# Altium schematic sheet stm32_ros_car.SchDoc
size A4
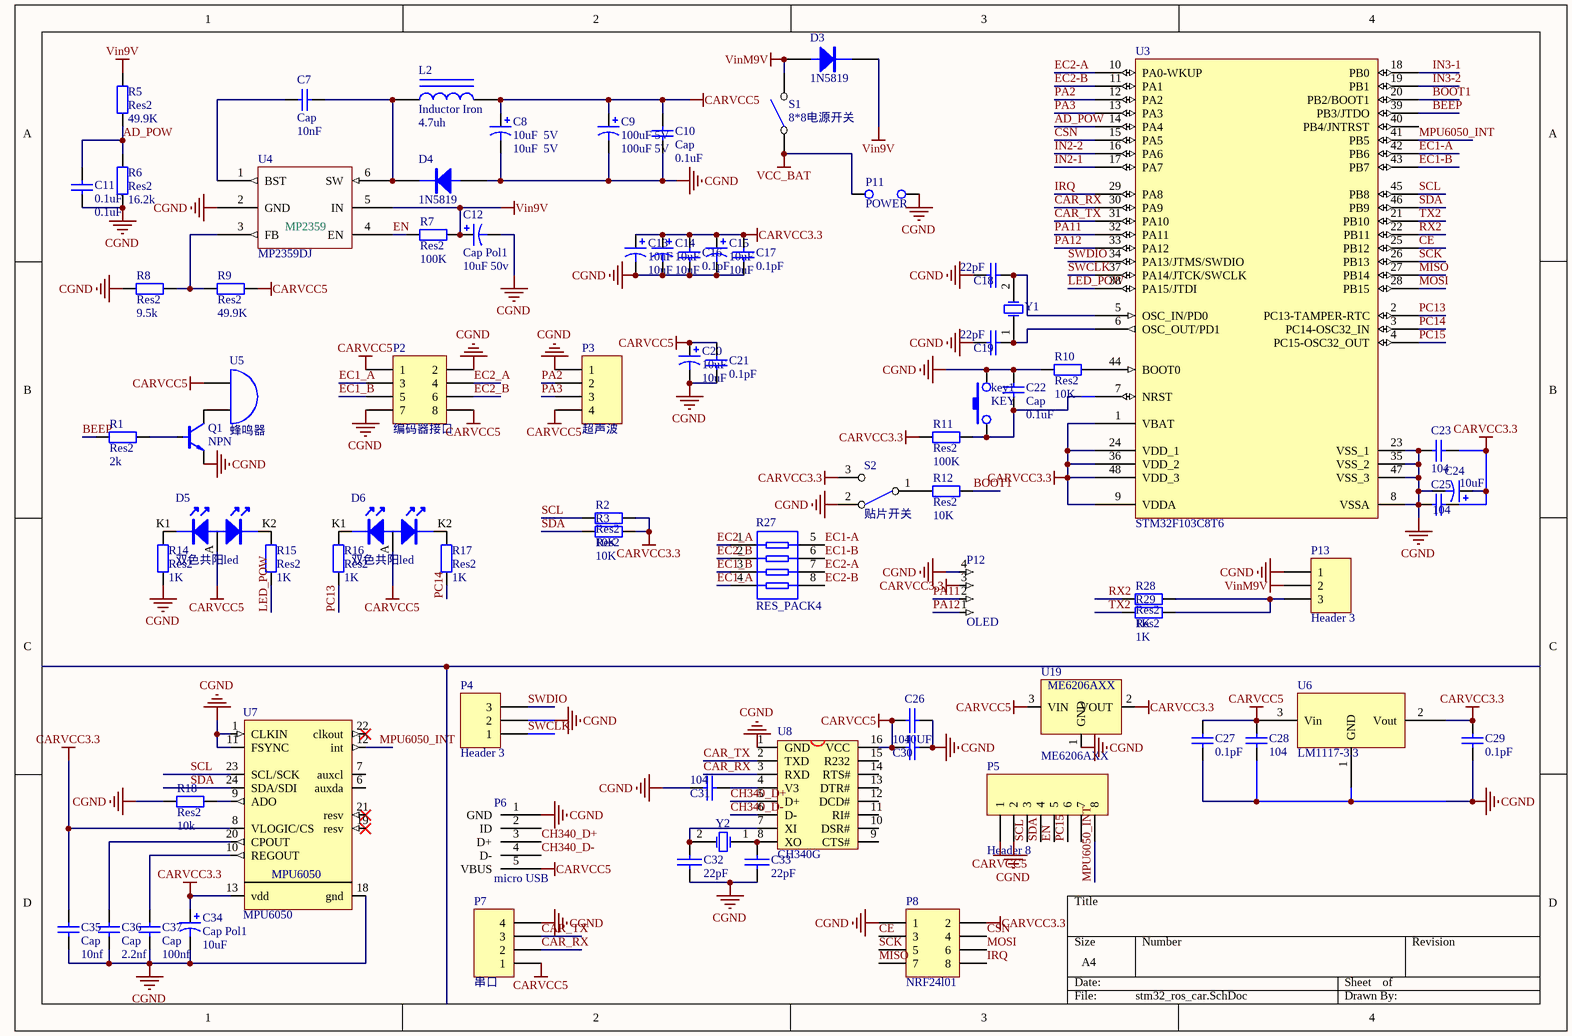
[diagram p0: stm32_ros_car.SchDoc]

## Parts
C7  Cap  value 10nF  [LC-0603_C]
C8  10uF  5V  [LC-1210_C]
C9  100uF 5V  [电容HONOR_63X77]
C10  Cap  value 0.1uF  [LC-0603_C]
C11  0.1uF  [LC-0603_C]
C12  Cap Pol1  value 10uF 50v  [电容HONOR_63X54]
C13  10uF  [电容HONOR_63X77]
C14  10uF  [LC-1210_C]
C15  10uF  [LC-1210_C]
C16  value 0.1pF  [LC-0603_C]  (hidden comment: Cap)
C17  value 0.1pF  [LC-0603_C]  (hidden comment: Cap)
C18  value 22pF  [LC-0603_C]  (hidden comment: CAP)
C19  value 22pF  [LC-0603_C]  (hidden comment: CAP)
C20  10uF  [LC-1210_C]
C21  value 0.1pF  [LC-0603_C]  (hidden comment: Cap)
C22  Cap  value 0.1uF  [LC-0603_C]
C23  value 104  [LC-0603_C]  (hidden comment: Cap)
C24  value 10uF  [LC-1210_C]
C25  value 104  [LC-0603_C]  (hidden comment: Cap)
C26  value 10UF  [LC-0603_C]  (hidden comment: CAP)
C27  value 0.1pF  [LC-0603_C]  (hidden comment: Cap)
C28  value 104  [LC-1210_C]  (hidden comment: Cap)
C29  value 0.1pF  [LC-0603_C]  (hidden comment: Cap)
C30  value 104  [LC-1206_C]  (hidden comment: CAP)
C31  value 104  [LC-0603_C]  (hidden comment: CAP)
C32  value 22pF  [LC-0603_C]  (hidden comment: CAP)
C33  value 22pF  [LC-0603_C]  (hidden comment: CAP)
C34  Cap Pol1  value 10uF  [LC-1210_C]
C35  Cap  value 10nf  [LC-0603_C]
C36  Cap  value 2.2nf  [LC-0603_C]
C37  Cap  value 100nf  [LC-0603_C]
D3  1N5819  [SMA]
D4  1N5819  [SMA]
D5  双色共阳led  [共阳双色LED]
D6  双色共阳led  [共阳双色LED]
key1  KEY  [SMD轻触按键]
L2  Inductor Iron  value 4.7uh  [电感GDCD4532]
P2  编码器接口  [HDR2X4]
P3  超声波  [HDR1X4]
P4  Header 3  [HDR1X3]
P5  Header 8  [HDR1X8]
P6  micro USB  [micro 5P沉板式0.8四脚全插无导位有孔]
P7  串口  [HDR1X4]
P8  NRF24l01  [HDR2X4]
P11  POWER  [电源]
P12  OLED  [1.0MM 翻盖 下接 FPC连接器 4P]
P13  Header 3  [AMP 3针连接件]
Q1  NPN  [LC-SOT-23]
R1  Res2  value 2k  [LC-0603_R]
R2  Res2  value 10K  [LC-0603_R]
R3  Res2  value 10K  [LC-0603_R]
R5  Res2  value 49.9K  [LC-0603_R]
R6  Res2  value 16.2k  [LC-0603_R]
R7  Res2  value 100K  [LC-0603_R]
R8  Res2  value 9.5k  [LC-0603_R]
R9  Res2  value 49.9K  [LC-0603_R]
R10  Res2  value 10K  [LC-0603_R]
R11  Res2  value 100K  [LC-0603_R]
R12  Res2  value 10K  [LC-0603_R]
R14  Res2  value 1K  [LC-0603_R]
R15  Res2  value 1K  [LC-0603_R]
R16  Res2  value 1K  [LC-0603_R]
R17  Res2  value 1K  [LC-0603_R]
R18  Res2  value 10k  [LC-0603_R]
R27  RES_PACK4  [RES4]
R28  Res2  value 1K  [LC-0603_R]
R29  Res2  value 1K  [LC-0603_R]
S1  8*8电源开关  [8*8自锁开关]
S2  贴片开关  [KEY]
U3  STM32F103C8T6  [LQFP48_L]
U4  MP2359DJ  [LC-SOT-23-6]
U5  蜂鸣器  [BELL]
U6  LM1117-3.3  [SOT223]
U7  MPU6050  [QFN24]
U8  CH340G  [SOP16M]
U19  ME6206AXX  [LC-SOT-89]
Y1  12MHz  [49SMD]  (value not drawn)
Y2  12MHz  [49SMD]  (value not drawn)

## Nets
CARVCC3.3: C13.1 C14.1 C15.1 C16.1 C17.1 C23.1 C24.1 C25.1 C29.1 C34.1 C35.2 P8.2 P12.3 R2.1 R3.1 R11.1 S2.3(NO1) U3.1(VBAT) U3.9(VDDA) U3.24(VDD_1) U3.36(VDD_2) U3.48(VDD_3) U6.2(Vout) U7.8(VLOGIC/CS) U7.13(vdd) U19.2(VOUT)
CARVCC5: C8.1 C9.1 C10.2 C20.1 C21.1 C26.2 C27.1 C28.2 C30.1 D5.A D6.A L2.2 P2.1 P2.8 P3.4 P5.1 P6.5(VBUS) P7.1 R9.1 U5.1(A) U6.3(Vin) U8.16(VCC) U19.3(VIN)
CGND: C8.2 C9.2 C10.1 C11.2 C12.2 C13.2 C14.2 C15.2 C16.2 C17.2 C18.1 C19.1 C20.2 C21.2 C22.2 C23.2 C24.2 C25.2 C26.1 C27.2 C28.1 C29.2 C30.2 C31.1 C32.1 C33.1 C34.2 C35.1 C36.1 C37.1 D4.A key1.2 P2.2 P2.7 P3.1 P4.2 P5.2 P6.1(GND) P7.4 P8.1 P11.2 P12.4 P13.1 Q1.E(e) R6.2 R8.2 R10.1 R14.1 R18.2 S2.2(NC1) U3.8(VSSA) U3.23(VSS_1) U3.35(VSS_2) U3.47(VSS_3) U4.2(GND) U6.1(GND) U7.1(CLKIN) U7.11(FSYNC) U7.18(gnd) U8.1(GND) U19.1(GND)
VCC_BAT: P11.1 S1.1(COMMON1)
Vin9V: C12.1 D3.K R5.1 R7.2 U4.5(IN)
VinM9V: D3.A P13.2 S1.2(NC1)
AD_POW: C11.1 R5.2 R6.1 U3.14(PA4)
BEEP: R1.2 U3.39(PB3/JTDO)
BOOT1: R12.1 U3.20(PB2/BOOT1)
CAR_RX: P7.2 U3.30(PA9) U8.3(RXD)
CAR_TX: P7.3 U3.31(PA10) U8.2(TXD)
CE: P8.3 U3.25(PB12)
CH340_D+: P6.3(D+) U8.5(D+)
CH340_D-: P6.4(D-) U8.6(D-)
CSN: P8.4 U3.15(PA5)
EC1-A: R27.5 U3.42(PB6)
EC1-B: R27.6 U3.43(PB7)
EC1_A: P2.3 R27.4
EC1_B: P2.5 R27.3
EC2-A: R27.7 U3.10(PA0-WKUP)
EC2-B: R27.8 U3.11(PA1)
EC2_A: P2.4 R27.1
EC2_B: P2.6 R27.2
EN: P5.5 R7.1 U4.4(EN)
IN2-1: U3.17(PA7)
IN2-2: U3.16(PA6)
IN3-1: U3.18(PB0)
IN3-2: U3.19(PB1)
IRQ: P8.8 U3.29(PA8)
LED_POW: R15.1 U3.38(PA15/JTDI)
MISO: P8.7 U3.27(PB14)
MOSI: P8.6 U3.28(PB15)
MPU6050_INT: P5.8 U3.41(PB5) U7.12(int)
PA2: P3.2 U3.12(PA2)
PA3: P3.3 U3.13(PA3)
PA11: P12.2 U3.32(PA11)
PA12: P12.1 U3.33(PA12)
PC13: R16.1 U3.2(PC13-TAMPER-RTC)
PC14: R17.1 U3.3(PC14-OSC32_IN)
PC15: P5.6 U3.4(PC15-OSC32_OUT)
RX2: R28.1 U3.22(PB11)
SCK: P8.5 U3.26(PB13)
SCL: P5.3 R2.2 U3.45(PB8) U7.23(SCL/SCK)
SDA: P5.4 R3.2 U3.46(PB9) U7.24(SDA/SDI)
SWCLK: P4.1 U3.37(PA14/JTCK/SWCLK)
SWDIO: P4.3 U3.34(PA13/JTMS/SWDIO)
TX2: R29.1 U3.21(PB10)
NetC7_1: C7.1 U4.1(BST)
NetC7_2: C7.2 D4.K L2.1 U4.6(SW)
NetC18_2: C18.2 U3.5(OSC_IN/PD0) Y1.2(OSC2)
NetC19_2: C19.2 U3.6(OSC_OUT/PD1) Y1.1(OSC1)
NetC22_1: C22.1 key1.1 R11.2 U3.7(NRST)
NetC31_2: C31.2 U8.4(V3)
NetC32_2: C32.2 U8.7(XI) Y2.2(OSC2)
NetC33_2: C33.2 U8.8(XO) Y2.1(OSC1)
NetC36_2: C36.2 U7.20(CPOUT)
NetC37_2: C37.2 U7.10(REGOUT)
NetD5_K1: D5.K1 R14.2
NetD5_K2: D5.K2 R15.2
NetD6_K1: D6.K1 R16.2
NetD6_K2: D6.K2 R17.2
NetP13_3: P13.3 R28.2 R29.2
NetQ1_B: Q1.B(b) R1.1
NetQ1_C: Q1.C(c) U5.2(B)
NetR8_1: R8.1 R9.2 U4.3(FB)
NetR10_2: R10.2 U3.44(BOOT0)
NetR12_2: R12.2 S2.1(COMMON1)
NetR18_1: R18.1 U7.9(ADO)

Not connected (* = marked no-connect by the designer): P5 7; P6 2(ID); U3 40(PB4/JNTRST); U7 6(auxda) 7(auxcl) 19(resv)* 21(resv)* 22(clkout)*; U8 9(CTS#) 10(DSR#) 11(RI#) 12(DCD#) 13(DTR#) 14(RTS#) 15(R232)

## Notes on the sheet
- (in symbol MP2359DJ) MP2359

## Library data of the parts
C7 C10 C11 C16 C17 C21-C23 C25 C27-C29 C35-C37 = Cap: Capacitor; Published: 8-Jun-2000; LatestRevisionDate: 17-Jul-2002; LatestRevisionNote: Re-released for DXP Platform.; PackageReference: RAD-0.3; Publisher: Altium Limited
  C11: Value: 0.1uF
C8 C9 C12-C15 C20 C24 C34 = Cap Pol1: Polarized Capacitor (Radial); Published: 8-Jun-2000; LatestRevisionDate: 17-Jul-2002; LatestRevisionNote: Re-released for DXP Platform.; PackageReference: RB7.6-15; Publisher: Altium Limited
  C8: Value: 10uF  5V
  C9: Value: 100uF 5V
  C13-C15 C20: Value: 10uF
D3 D4 = 1N4001: pin to pad: A>1 K>2
D5 D6 = 双色共阳led: pin to pad: A>2 K1>1 K2>3
L2 = Inductor Iron: Magnetic-Core Inductor; Published: 24-Mar-1999; LatestRevisionDate: 17-Jul-2002; LatestRevisionNote: Re-released for DXP Platform.; PackageReference: AXIAL-0.9; Publisher: Altium Limited
P2 P8 = Header 4X2: Header, 4-Pin, Dual row; LatestRevisionDate: 17-Jul-2002; LatestRevisionNote: Re-released for DXP Platform.; Publisher: Altium Limited
P3 P7 = Header 4: Header, 4-Pin; LatestRevisionDate: 17-Jul-2002; LatestRevisionNote: Re-released for DXP Platform.; Publisher: Altium Limited
P4 P13 = Header 3: Header, 3-Pin; LatestRevisionDate: 17-Jul-2002; LatestRevisionNote: Re-released for DXP Platform.; Publisher: Altium Limited
P5 = Header 8: Header, 8-Pin; LatestRevisionDate: 17-Jul-2002; LatestRevisionNote: Re-released for DXP Platform.; Publisher: Altium Limited
P6 = micro 5P
P12 = FPC 4P 1MM
Q1 = NPN: pin to pad: B>1 C>3 E>2
R1-R3 R5-R12 R14-R18 R28 R29 = Res2: Resistor; Published: 8-Jun-2000; LatestRevisionDate: 17-Jul-2002; LatestRevisionNote: Re-released for DXP Platform.; PackageReference: AXIAL-0.4; Publisher: Altium Limited
S1 = 8*8电源开关: pin to pad: 1>2 2>1
S2 = 贴片开关: pin to pad: 1>2 2>1
U3 = STM32F103C8T6: STM32 ARM-based 32-bit MCU with 64 Kbytes Flash, 48-pin LQFP, Industrial Temperature; Published: 30-May-2008; DatasheetVersion: rev6, Mar-2008; PackageVersion: Mar-2008; PackageReference: LQFP48; Publisher: Altium Limited; PackageDescription: 48-Pin Low-Profile Quad Flat Pack, 7 x 7 mm Body, 0.5 mm Pitch (LQFP48); ComponentLink1Description: Manufacturer Link; ComponentLink1URL: www.st.com/stm32; ComponentLink2Description: Datasheet; ComponentLink2URL: http://www.st.com/stonline/products/literature/ds/13587.pdf
U5 = 蜂鸣器: Bell
U8 = CH340G: USB2UART
Y1 Y2 = XTAL: Crystal Oscillator; Value: 8MHZ; Published: 8-Jun-2000; LatestRevisionDate: 17-Jul-2002; LatestRevisionNote: Re-released for DXP Platform.; Publisher: Altium Limited